# EAGLE design hvac-sensors-v1 (EAGLE 6.4)
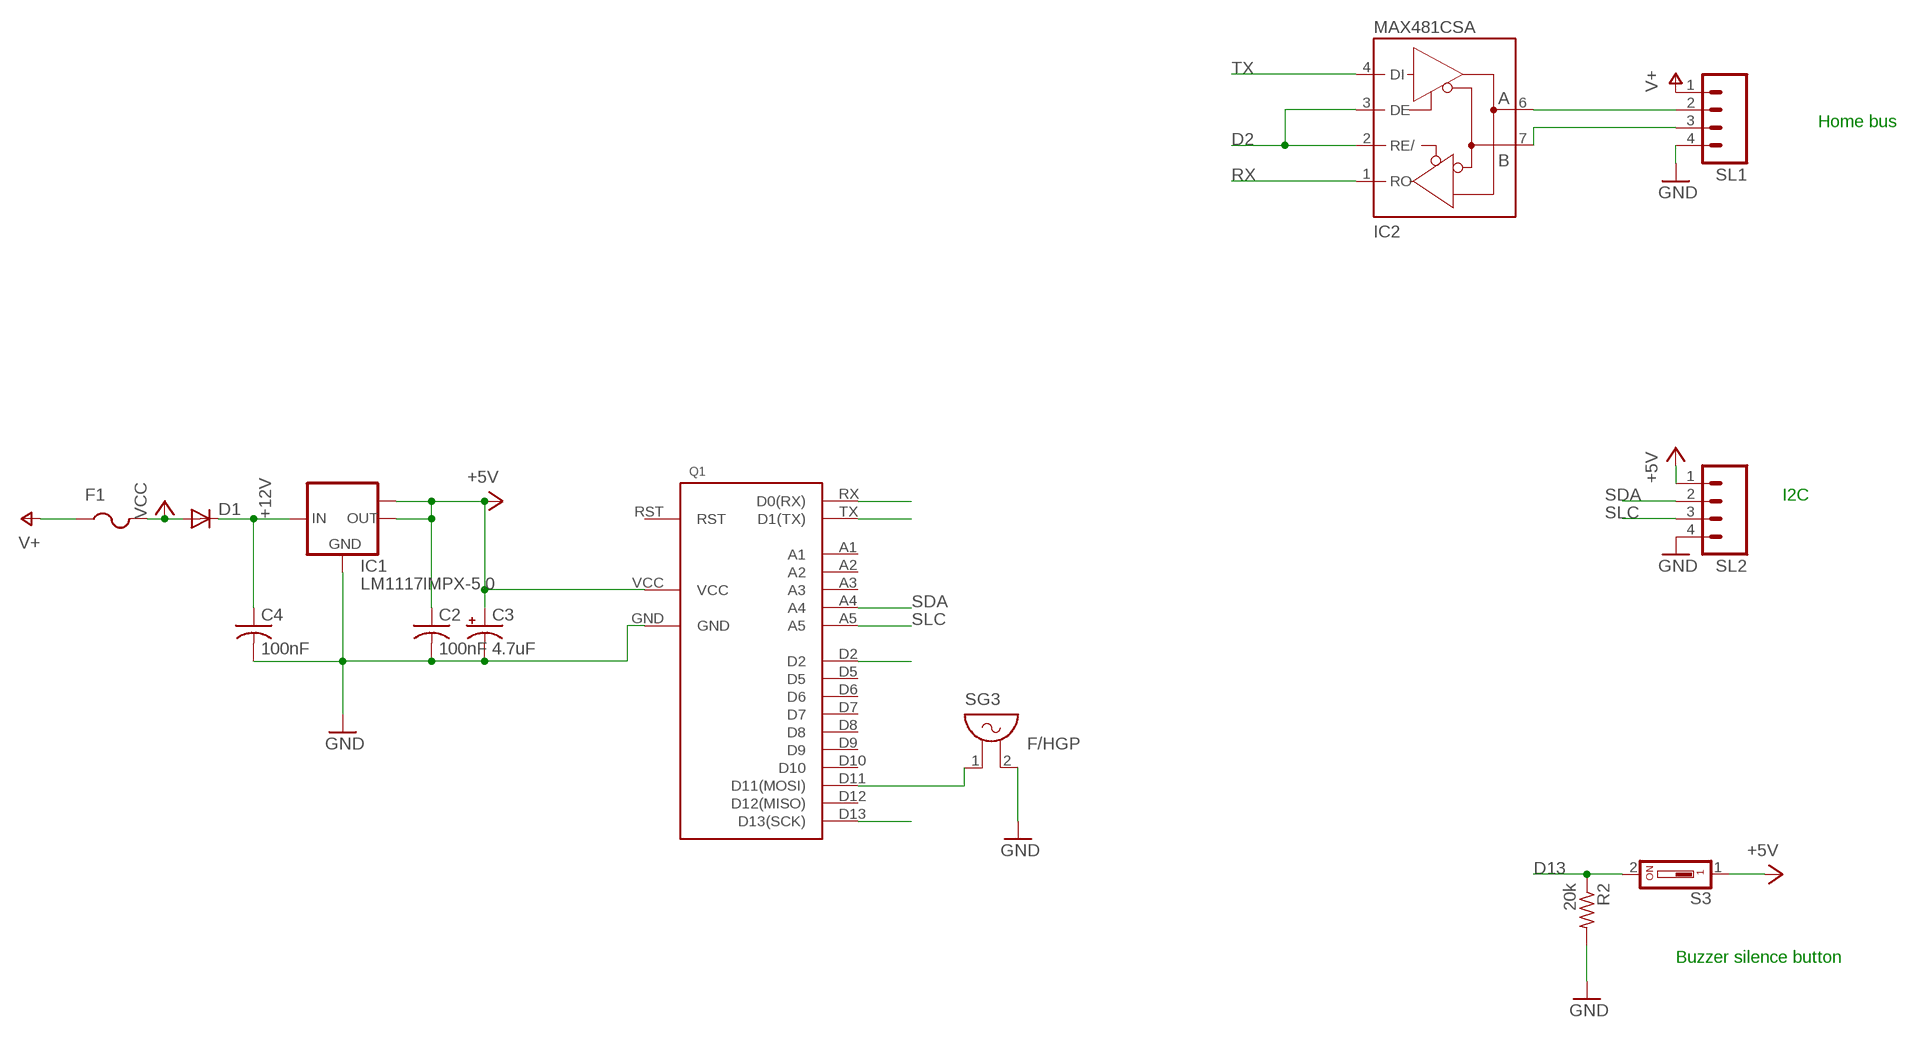
[diagram p0: schematic, sheet 1]

## Parts
C2  100nF  C-USC0603K  [C0603K]
C3  4.7uF  CPOL-USE1.8-4  [E1,8-4]
C4  100nF  C-USC0603K  [C0603K]
D1  DIODE-MICROMELF-W  [MICROMELF-W]
F1  PTCFUSE-1812  [1812]
IC1  LM1117IMPX-5.0  [SOT223]
IC2  MAX481CSA  [SO08]
Q1  HOME-CPU-V1  [HOME-CPU-V1]
R2  20k  R-US_R0603  [R0603]
S3  DS01  [DS-01]
SG3  F/HGP  [F/HGP]
SL1  M04  [04P]
SL2  M04  [04P]

## Nets
+12V: C4.1 D1.C IC1.3(IN)
D2: IC2.2(RE/) IC2.3(DE) Q1.D2
D13: Q1.D13(D13(SCK)) R2.1 S3.2
GND: C2.2 C3.- C4.2 IC1.1(GND) Q1.GND R2.2 SG3.2 SL1.4 SL2.4
N$1: D1.A F1.2 ; supply symbol labelled VCC
N$2: Q1.D11(D11(MOSI)) SG3.1
N$3: IC2.6(A) SL1.2
N$4: IC2.7(B) SL1.3
RX: IC2.1(RO) Q1.RX(D0(RX))
SDA: Q1.A4 SL2.2
SLC: Q1.A5 SL2.3
TX: IC2.4(DI) Q1.TX(D1(TX))
V+: F1.1 SL1.1
VCC: C2.1 C3.+ IC1.2(OUT) IC1.TAB(OUT1) Q1.VCC S3.1 SL2.1 ; supply symbol labelled +5V
Unconnected: Q1.A1 Q1.A2 Q1.A3 Q1.D5 Q1.D6 Q1.D7 Q1.D8 Q1.D9 Q1.D10 Q1.D12(D12(MISO)) Q1.RST

## Notes on the sheet
- Home bus
- I2C
- Buzzer silence button

## Power pins joined to a net without a drawn wire
GND: IC2.5(GND)
VCC: IC2.8(VCC)

## Library data of the parts
C2 C4 = adafruit:C-US: CAPACITOR, American symbol
C3 = adafruit:CPOL-US: POLARIZED CAPACITOR, American symbol
D1 = diode:DIODE-: DIODE
F1 = adafruit:PTCFUSE: PTC fuses, resettable thermistors
IC1 = lm1117:LM1117IMPX-*
IC2 = maxim:MAX481CSA: RS485 TRANSEIVER; MF: MAXIM; MPN: MAX481CSA; OC_FARNELL: unknown; OC_NEWARK: 90C3817
Q1 = serge:HOME-CPU-V1
R2 = adafruit:R-US_: RESISTOR, American symbol
S3 = switch-dil:DS01: DIL/CODE SWITCH; OC_FARNELL: unknown; OC_NEWARK: unknown
SG3 = buzzer:F/HGP: BUZZER Source: Buerklin; OC_FARNELL: unknown; OC_NEWARK: unknown
SL1 SL2 = con-amp-quick:M04: AMP QUICK CONNECTOR; OC_FARNELL: unknown; OC_NEWARK: unknown

## Board
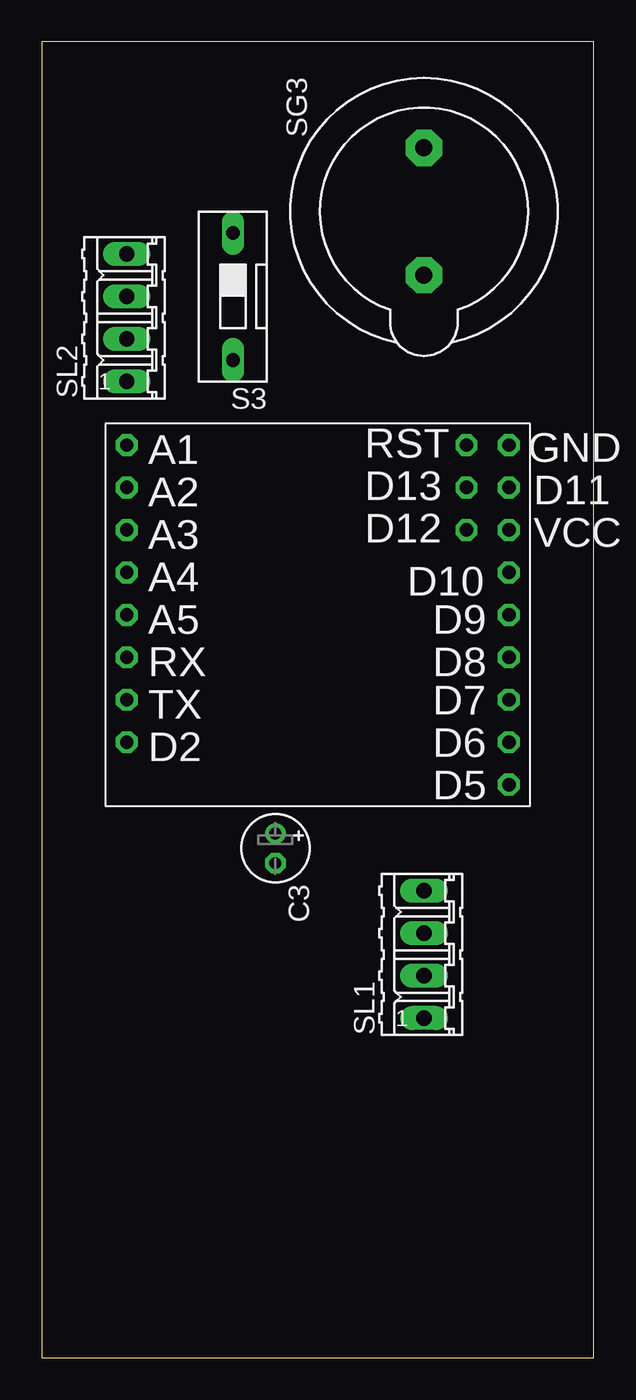
[diagram p1: board, top side]
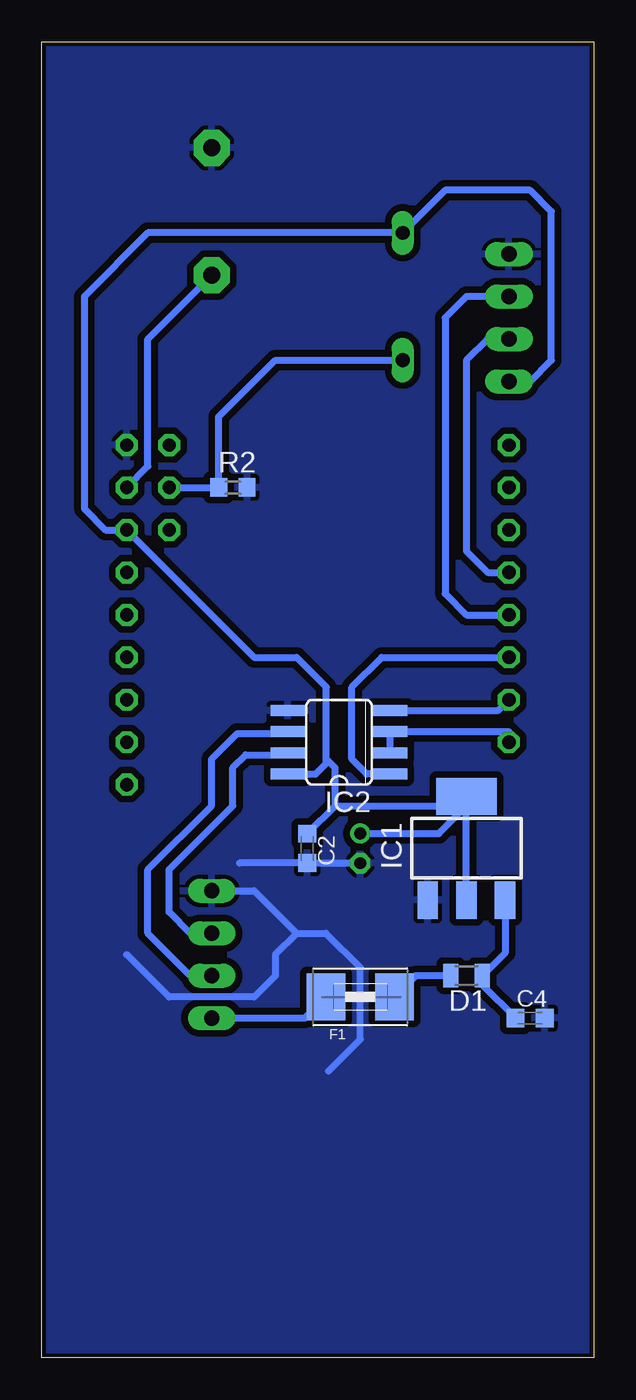
[diagram p2: board, bottom side, seen from below]

Size 33.02 x 78.74 mm. Coordinates in mm from the lower left corner, seen from the top.
Outline: 0,0 33.02,0 33.02,78.74 0,78.74 0,0
Copper layers (1*16): Top 0.035mm / dielectric 1.5mm / Bottom 0.035mm
Design rules "default *": minimum track width 10mil, minimum drill 24mil, track to track 16mil, track to pad 16mil, pad to pad 16mil, via to via 16mil, smd to smd 16mil, copper to edge 10mil, drill to drill 8mil, minimum pad ring 10mil, minimum via ring 8mil, stop-mask expansion 4mil, vias tented up to drill 0mil, thermal gap 10mil

### Footprints (pad centres in the part's own frame; a part is rotated, then mirrored left to right if it is on the bottom)
C0603K = smd 1.05 x 1.08: 1 -0.875,0; 2 0.875,0
E1,8-4 = drill 0.711 pad 1.168: + -0.889,0 | drill 0.711 pad 1.168 octagon: - 0.889,0
MICROMELF-W = smd 0.9 x 1.4: A 0.95,0; C -0.95,0
1812 = smd 2.286 x 2.794: 1 -2.046,0; 2 2.046,0
SOT223 = smd 1.219 x 2.235: 1 -2.311,-3.099; 2 0,-3.099; 3 2.311,-3.099 | smd 3.6 x 2.2: TAB 0,3.099
SO08 = smd 0.66 x 2.032: 1 -1.905,-3.073; 2 -0.635,-3.073; 3 0.635,-3.073; 4 1.905,-3.073; 5 1.905,3.073; 6 0.635,3.073; 7 -0.635,3.073; 8 -1.905,3.073
HOME-CPU-V1 = drill 0.8 octagon: A1 5.08,22.86; A2 2.54,22.86; A3 0,22.86; A4 -2.54,22.86; A5 -5.08,22.86; D2 -12.7,22.86; D5 -15.24,0; D6 -12.7,0; D7 -10.16,0; D8 -7.62,0; D9 -5.08,0; D10 -2.54,0; D11 2.54,0; D12 0,2.54; D13 2.54,2.54; GND 5.08,0; RST 5.08,2.54; RX -7.62,22.86; TX -10.16,22.86; VCC 0,0
R0603 = smd 1 x 1.1: 1 -0.85,0; 2 0.85,0
DS-01 = drill 0.813 long: 1 0,-3.81; 2 0,3.81
F/HGP = drill 1.016 pad 2.159 octagon: 1 -3.81,0; 2 3.81,0
04P = drill 0.914 long: 1 -3.81,0; 2 -1.27,0; 3 1.27,0; 4 3.81,0

### Placement (x,y rotation side)
C2  17.14,30.48 270 bottom
C3  13.97,30.48 270 top
C4  3.81,20.32 0 bottom
D1  7.62,22.86 180 bottom
F1  13.97,21.59 0 bottom
IC1  7.62,30.48 0 bottom
IC2  15.24,36.83 90 bottom
Q1  27.94,49.53 90 top
R2  21.59,52.07 0 bottom
S3  11.43,63.5 180 top
SG3  22.86,68.58 90 top
SL1  22.86,24.13 90 top
SL2  5.08,62.23 90 top

### Tracks (layer width: path | path; a pad name or v marks a point on that pad's centre or on a via)
+12V
  Bottom 0.406: C4.1 6.67,22.3 D1.C 5.31,24.22 IC1.3
D2
  Bottom 0.406: IC2.2 IC2.3 5.08,37.46 Q1.D2
D13
  Bottom 0.406: Q1.D13 R2.1 22.44,56.3 19.05,59.69 S3.2
GND
  Bottom 0.406: 15.88,17.14 13.97,19.05 13.97,23.34 16.03,25.4 17.78,25.4 | SL1.4 20.32,27.94 17.78,25.4 | 21.2,29.61 C2.2 13.98,29.61 C3.- | 17.78,25.4 19.05,24.13 19.05,22.86 20.32,21.59 25.4,21.59 27.94,24.13
  pour Bottom: -1.27,78.74 33.02,78.74 33.02,0 7.62,0 7.62,3.81 0,3.81
N$1
  Bottom 0.406: D1.A 10.65,22.86 F1.2
N$2
  Bottom 0.406: Q1.D11 26.67,53.34 26.67,60.96 SG3.1
N$3
  Bottom 0.406: SL1.2 24.13,22.86 26.67,25.4 26.67,29.21 22.86,33.02 22.86,35.81 21.34,37.34 18.44,37.34 IC2.6
N$4
  Bottom 0.406: SL1.3 24.13,25.4 25.4,26.67 25.4,29.21 21.59,33.02 21.59,35.31 20.83,36.07 18.44,36.07 IC2.7
N$5
  pour Bottom: 0,0 0,6.35 10.16,6.35 10.16,0
RX
  Bottom 0.406: IC2.1 13.59,34.92 14.48,35.81 14.48,40.13 12.7,41.91 Q1.RX
SDA
  Bottom 0.406: SL2.2 6.35,60.96 7.62,59.69 7.62,48.26 6.35,46.99 Q1.A4
SLC
  Bottom 0.406: SL2.3 7.62,63.5 8.89,62.23 8.89,45.72 7.62,44.45 Q1.A5
TX
  Bottom 0.406: IC2.4 5.71,38.73 Q1.TX
V+
  Bottom 0.406: SL1.1 17.29,20.32 F1.1
VCC
  Bottom 0.406: 15.48,33.02 7.62,33.02 | 7.62,33.02 IC1.TAB | C3.+ 9.27,31.37 7.62,33.02 | 15.48,33.02 C2.1 | IC2.8 16.64,34.92 16,35.56 16,35.81 | 16,35.81 16,40.13 17.78,41.91 20.32,41.91 Q1.VCC 29.21,49.53 30.48,50.8 30.48,63.5 26.67,67.31 S3.1 8.89,69.85 3.81,69.85 2.54,68.58 2.54,59.69 3.81,58.42 SL2.1 | 15.48,33.02 15.48,35.29 16,35.81 | IC1.2 7.62,33.02